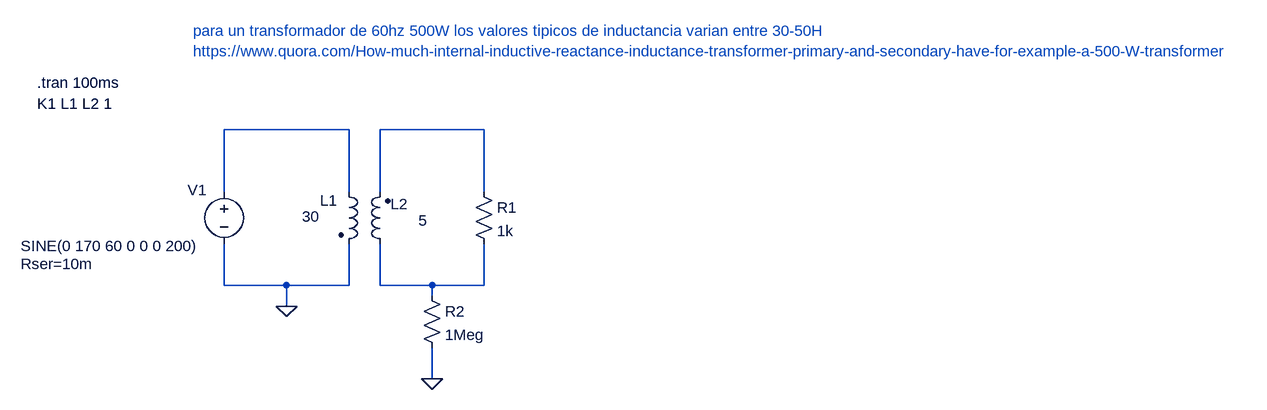
[diagram p0: schematic TranformerDemo.asc]
TranformerDemo.asc, the LTspice schematic file:
Version 4
SHEET 1 1716 680
WIRE 96 32 -96 32
WIRE 304 32 144 32
WIRE -96 128 -96 32
WIRE 96 128 96 32
WIRE 144 128 144 32
WIRE 304 128 304 32
WIRE -96 272 -96 208
WIRE 0 272 -96 272
WIRE 96 272 96 208
WIRE 96 272 0 272
WIRE 144 272 144 208
WIRE 224 272 144 272
WIRE 304 272 304 208
WIRE 304 272 224 272
WIRE 224 288 224 272
WIRE 0 304 0 272
WIRE 224 416 224 368
FLAG 0 304 0
FLAG 224 416 0
SYMBOL ind2 80 112 R0
WINDOW 0 -28 29 Left 2
WINDOW 3 -56 54 Left 2
SYMATTR InstName L1
SYMATTR Value 30
SYMATTR Type ind
SYMATTR SpiceLine Rser=80m
SYMBOL ind2 160 224 R180
WINDOW 0 -27 77 Left 2
WINDOW 3 -57 52 Left 2
SYMATTR InstName L2
SYMATTR Value 5
SYMATTR Type ind
SYMATTR SpiceLine Rser=10m
SYMBOL voltage -96 112 R0
WINDOW 0 -56 13 Left 2
WINDOW 3 -313 99 Left 2
WINDOW 123 0 0 Left 0
WINDOW 39 -313 127 Left 2
SYMATTR InstName V1
SYMATTR Value SINE(0 170 60 0 0 0 200)
SYMATTR SpiceLine Rser=10m
SYMBOL res 288 112 R0
SYMATTR InstName R1
SYMATTR Value 1k
SYMBOL res 208 272 R0
SYMATTR InstName R2
SYMATTR Value 1Meg
TEXT -384 -40 Left 2 !.tran 100ms
TEXT -384 -8 Left 2 !K1 L1 L2 1
TEXT -144 -120 Left 2 ;para un transformador de 60hz 500W los valores tipicos de inductancia varian entre 30-50H\nhttps://www.quora.com/How-much-internal-inductive-reactance-inductance-transformer-primary-and-secondary-have-for-example-a-500-W-transformer

The netlist it stands for:
* TranformerDemo.asc
L1 N001 0 30 Rser=80m
L2 N003 N002 5 Rser=10m
V1 N001 0 SINE(0 170 60 0 0 0 200) Rser=10m
R1 N002 N003 1k
R2 N003 0 1Meg
.tran 100ms
K1 L1 L2 1
* para un transformador de 60hz 500W los valores tipicos de inductancia varian entre 30-50H
* https://www.quora.com/How-much-internal-inductive-reactance-inductance-transformer-primary-and-secondary-have-for-example-a-500-W-transformer
.backanno
.end